# Altium schematic sheet IMU.SchDoc
size A4; SheetNumber: 5; SheetTotal: 15
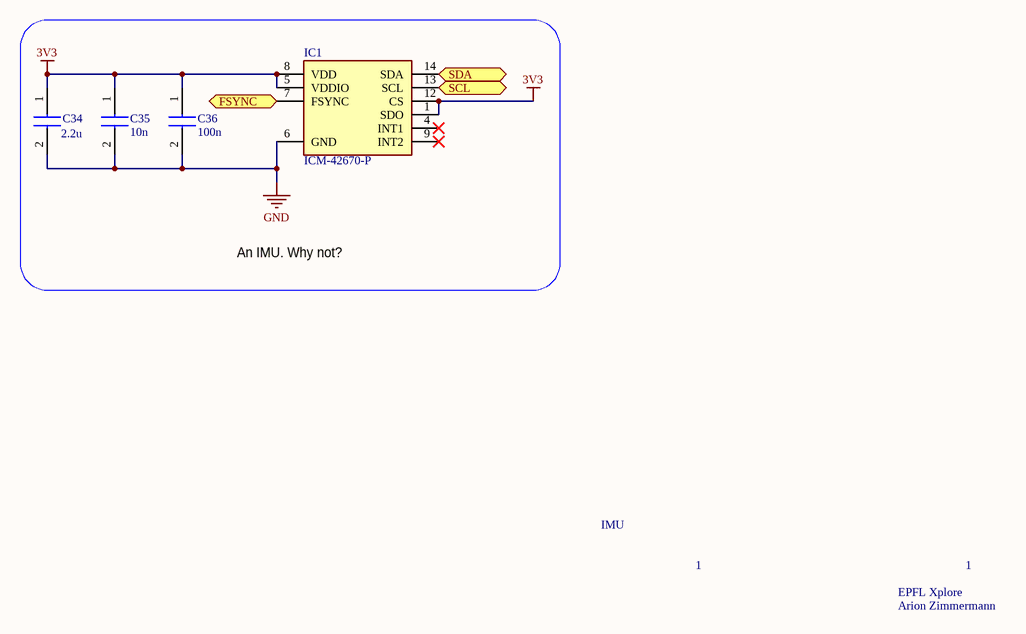
[diagram p0: IMU.SchDoc]

## Parts
C34  value 2.2u  [C1206]  (hidden comment: C1206J225J4RACAUTO)
C35  value 10n  [CAPC1608X95N]  (hidden comment: C0603C103K5RACTU)
C36  value 100n  [CAPC1608X95N]  (hidden comment: C0603C104K5RACTU)
IC1  ICM-42670-P  [ICM42670P]

## Ports
FSYNC (bidir), SCL (bidir), SDA (bidir)

## Nets
3V3: C34.1 C35.1 C36.1 IC1.1(SDO) IC1.5(VDDIO) IC1.8(VDD) IC1.12(CS)
GND: C34.2 C35.2 C36.2 IC1.6(GND)
FSYNC: IC1.7(FSYNC) ; port FSYNC
SCL: IC1.13(SCL) ; port SCL
SDA: IC1.14(SDA) ; port SDA

Not connected (* = marked no-connect by the designer): IC1 4(INT1)* 9(INT2)*

## Notes on the sheet
- An IMU. Why not?
- IMU
- 1
- EPFL Xplore
- Arion Zimmermann

## Library data of the parts
C34 = C1206C106K4RACTU: Capacitor; Manufacturer_Name: Kemet; Datasheet Link: https://content.kemet.com/datasheets/KEM_C1002_X7R_SMD.pdf; Manufacturer_Part_Number: C1206C106K4RACTU; Mouser Part Number: 80-C1206C106K4R; Mouser Price/Stock: https://www.mouser.co.uk/ProductDetail/KEMET/C1206C106K4RACTU?qs=guDyKOyRtV0mxqxQedB7kA%3D%3D; Arrow Part Number: C1206C106K4RACTU; Arrow Price/Stock: https://www.arrow.com/en/products/c1206c106k4ractu/kemet-corporation
C35 C36 = C0603C104K5RACTU: Capacitor; Manufacturer_Name: Kemet; Datasheet Link: http://www.farnell.com/datasheets/2205446.pdf; Height: 0.95mm; Manufacturer_Part_Number: C0603C104K5RACTU; Mouser Part Number: 80-C0603C104K5R; Mouser Price/Stock: https://www.mouser.co.uk/ProductDetail/KEMET/C0603C104K5RACTU?qs=l5k%252BbMnNDkkVcnZPSAaaiQ%3D%3D; Arrow Part Number: C0603C104K5RACTU; Arrow Price/Stock: https://www.arrow.com/en/products/c0603c104k5ractu/kemet-corporation; Supplier 1: Mouser; Supplier Part Number 1: 80-C0603C104K5R
IC1 = ICM-42670-P: Integrated Circuit; Manufacturer_Name: TDK; Datasheet Link: https://3cfeqx1hf82y3xcoull08ihx-wpengine.netdna-ssl.com/wp-content/uploads/2021/07/DS-000451-ICM-42670-P-v1.0.pdf; Manufacturer_Part_Number: ICM-42670-P; Mouser Part Number: 410-ICM-42670-P; Mouser Price/Stock: https://www.mouser.co.uk/ProductDetail/TDK-InvenSense/ICM-42670-P?qs=iLbezkQI%252BsgK8sMF5V7fQQ%3D%3D; Arrow Part Number: ICM-42670-P; Arrow Price/Stock: https://www.arrow.com/en/products/icm-42670-p/invensense?region=nac